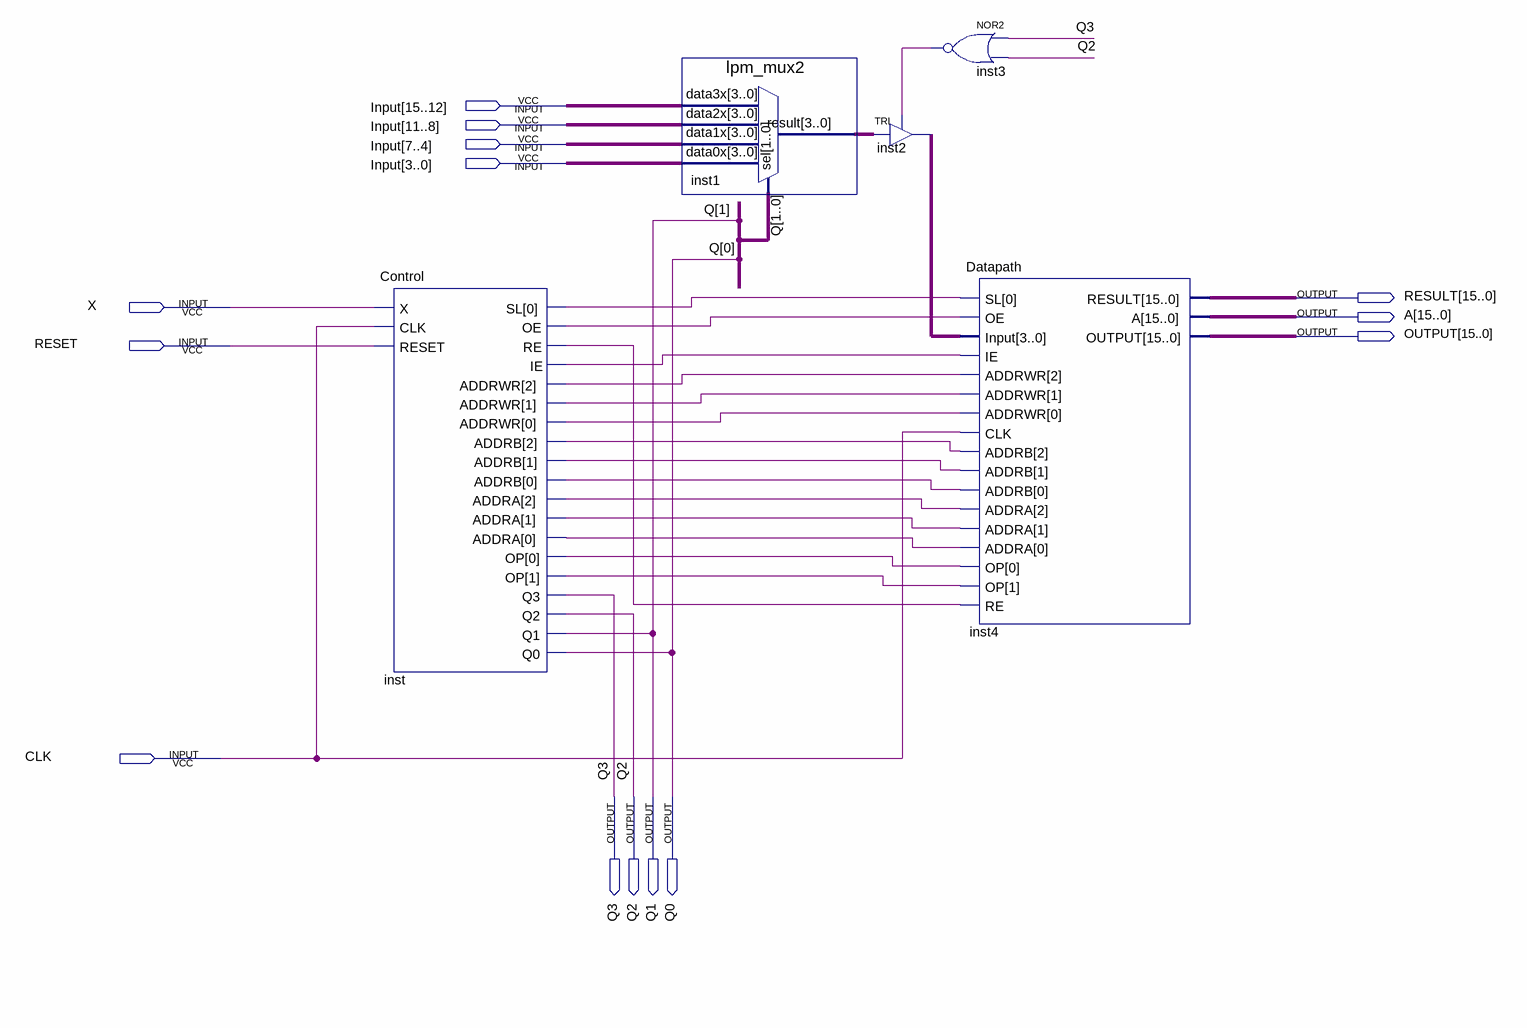
[diagram p0: schematic sheet]
// Quartus schematic LAB4.bdf as structural Verilog: 5 symbols, 14 pins
module LAB4 (
  input  [15:0] Input,
  input  X,
  input  RESET,
  input  CLK,
  output [15:0] RESULT,
  output [15:0] A,
  output [15:0] OUTPUT,
  output Q3,
  output Q2,
  output Q1,
  output Q0
);

  wire inst3_out, inst_addra, inst_addra_2, inst_addra_3, inst_addrb, inst_addrb_2, inst_addrb_3,
       inst_addrwr, inst_addrwr_2, inst_addrwr_3, inst_ie, inst_oe, inst_op, inst_op_2, inst_re, inst_sl;
  wire [3:0] inst1_result, inst2_out;

  Control inst (
    .X(X), .CLK(CLK), .RESET(RESET), .SL(inst_sl), .OE(inst_oe), .RE(inst_re), .IE(inst_ie),
    .ADDRWR({inst_addrwr_3, inst_addrwr_2, inst_addrwr}), .ADDRB({inst_addrb, inst_addrb_2, inst_addrb_3}),
    .ADDRA({inst_addra, inst_addra_2, inst_addra_3}), .OP({inst_op_2, inst_op}), .Q3(Q3), .Q2(Q2), .Q1(Q1),
    .Q0(Q0));
  lpm_mux2 inst1 (
    .data3x(Input[15:12]), .data2x(Input[11:8]), .data1x(Input[7:4]), .data0x(Input[3:0]), .sel({Q1, Q0}),
    .result(inst1_result));
  TRI inst2[3:0] (.IN(inst1_result), .OE(inst3_out), .OUT(inst2_out));
  nor inst3 (inst3_out, Q3, Q2);
  Datapath inst4 (
    .SL(inst_sl), .OE(inst_oe), .Input(inst2_out), .IE(inst_ie),
    .ADDRWR({inst_addrwr_3, inst_addrwr_2, inst_addrwr}), .CLK(CLK),
    .ADDRB({inst_addrb, inst_addrb_2, inst_addrb_3}), .ADDRA({inst_addra, inst_addra_2, inst_addra_3}),
    .OP({inst_op_2, inst_op}), .RE(inst_re), .RESULT(RESULT), .A(A), .OUTPUT(OUTPUT));
endmodule
